# EAGLE design DRL (EAGLE 8.3.2)
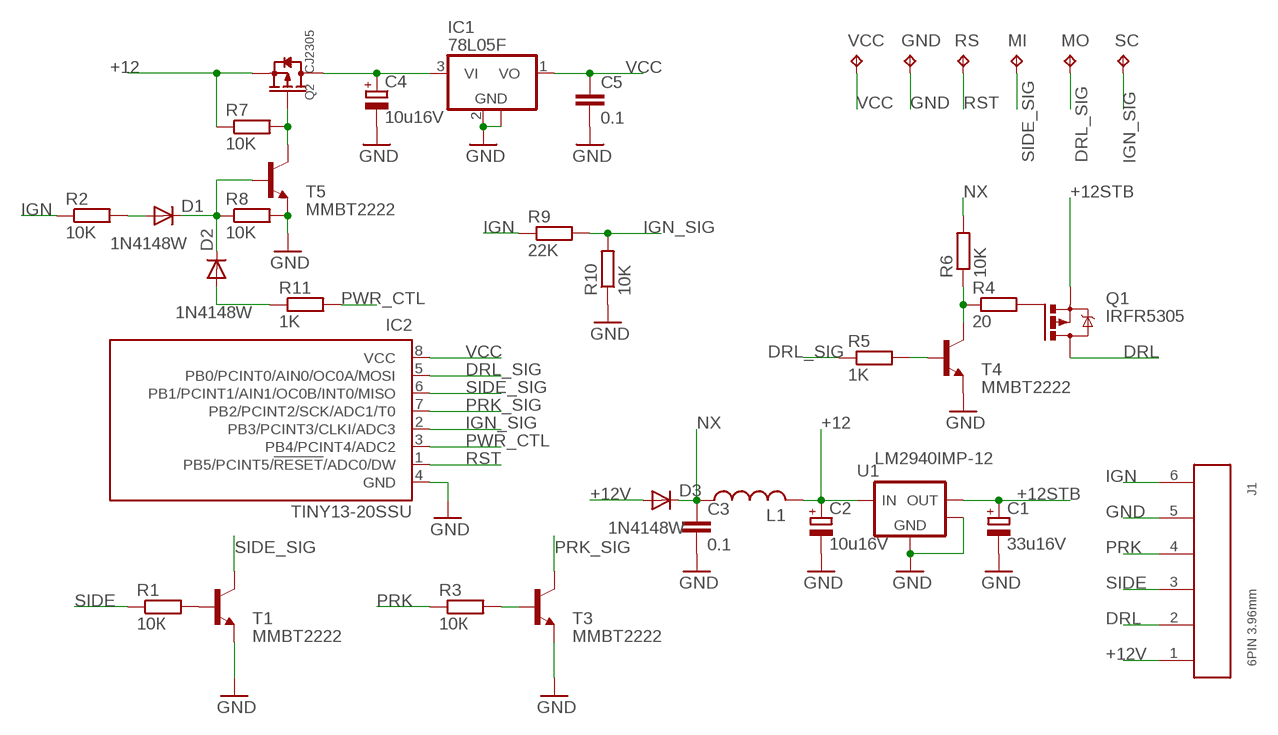
[diagram p0: schematic, sheet 1]

## Parts
C1  33u16V  CPOL-EUSMCB  [SMC_B]
C2  10u16V  CPOL-EUSMCB  [SMC_B]
C3  0.1  C-EUC0805  [C0805]
C4  10u16V  CPOL-EUSMCB  [SMC_B]
C5  0.1  C-EUC0805  [C0805]
D1  1N4148W  DIODE-DO214AC  [DO214AC]
D2  1N4148W  DIODE-DO214AC  [DO214AC]
D3  1N4148W  DIODE-DO214AC  [DO214AC]
GND  TPB2,54  [B2,54]
IC1  78L05F  [SOT89]
IC2  TINY13-20SSU  [8S1]
J1  6PIN 3.96mm  645006114822  [645006114822]
L1  L-USL5038P  [L5038P]
MI  TPB2,54  [B2,54]
MO  TPB2,54  [B2,54]
Q1  IRFR5305  [D-PAK_TO252AA]
Q2  CJ2305  SMD-MOSFET-P-CH-8V-4.1A-CJ2305(SOT-23)  [SOT-23]
R1  10К  R-EU_R0805W  [R0805W]
R2  10K  R-EU_R0805W  [R0805W]
R3  10К  R-EU_R0805W  [R0805W]
R4  20  R-EU_R0805W  [R0805W]
R5  1K  R-EU_R0805W  [R0805W]
R6  10K  R-EU_R0805W  [R0805W]
R7  10K  R-EU_R0805W  [R0805W]
R8  10K  R-EU_R0805W  [R0805W]
R9  22K  R-EU_R0805W  [R0805W]
R10  10K  R-EU_R0805W  [R0805W]
R11  1K  R-EU_R0805W  [R0805W]
RS  TPB2,54  [B2,54]
SC  TPB2,54  [B2,54]
T1  MMBT2222  MMBT2222ALT1-NPN-SOT23-BEC  [SOT23-BEC]
T3  MMBT2222  MMBT2222ALT1-NPN-SOT23-BEC  [SOT23-BEC]
T4  MMBT2222  MMBT2222ALT1-NPN-SOT23-BEC  [SOT23-BEC]
T5  MMBT2222  MMBT2222ALT1-NPN-SOT23-BEC  [SOT23-BEC]
U1  LM2940IMP-12  LM2940DCY  [SOT-223-3]
VCC  TPB2,54  [B2,54]

## Nets
+12: C2.+ L1.2 Q2.2(S) R7.1 U1.1(VIN)
+12STB: C1.+ Q1.3(S) U1.3(VOUT)
+12V: D3.A J1.1
DRL: J1.2 Q1.4(D)
DRL_SIG: IC2.5(PB0/PCINT0/AIN0/OC0A/MOSI) MO.TP R5.1
GND: C1.- C2.- C3.2 C4.- C5.2 GND.TP IC1.2(GND) IC1.2@1(GND) IC2.4(GND) J1.5 R8.2 R10.1 T1.E T3.E T4.E T5.E U1.2(GND) U1.4(TAB)
IGN: J1.6 R2.1 R9.1
IGN_SIG: IC2.2(PB3/PCINT3/CLKI/ADC3) R9.2 R10.2 SC.TP
N$1: R1.2 T1.B
N$2: R3.2 T3.B
N$3: D1.A R2.2
N$4: C4.+ IC1.3(VI) Q2.3(D)
N$5: Q2.1(G) R7.2 T5.C
N$6: Q1.1(G) R4.2
N$7: D1.C D2.C R8.1 T5.B
N$8: D2.A R11.1
N$12: R4.1 R6.1 T4.C
N$13: R5.2 T4.B
NX: C3.1 D3.C L1.1 R6.2
PRK: J1.4 R3.1
PRK_SIG: IC2.7(PB2/PCINT2/SCK/ADC1/T0) T3.C
PWR_CTL: IC2.3(PB4/PCINT4/ADC2) R11.2
RST: IC2.1(PB5/PCINT5/!RESET!/ADC0/DW) RS.TP
SIDE: J1.3 R1.1
SIDE_SIG: IC2.6(PB1/PCINT1/AIN1/OC0B/INT0/MISO) MI.TP T1.C
VCC: C5.1 IC1.1(VO) IC2.8(VCC) VCC.TP

## Library data of the parts
C1 C2 C4 = rcl:CPOL-EU: POLARIZED CAPACITOR, European symbol
C3 C5 = rcl:C-EU: CAPACITOR, European symbol
D1-D3 = diode:DIODE-: DIODE
GND MI MO RS SC VCC = testpad:TP: Test pad
IC1 = linear:78L*: POSITOIV-VOLTAGE REGULATORS Output up to 100 mA Source: Datasheet <http://focus.ti.com/lit/ds/symlink/ua78l05.pdf>
IC2 = atmel:TINY13: 8-bit AVR Microcontroller with 1K Bytes In-System Programmable Flash Source: http://www.atmel.com/dyn/resources/prod_documents/2535S.pdf; MPN: ATTINY13-20SSU; OC_FARNELL: 1455133; OC_NEWARK: 58M3771
J1 = Wurth_Elektronik_Electromechanic_Wire_to_Board_Connectors_rev17b:645006114822: WR-WTB 3.96mm Male Locking Header, 6 Pins=>Code : Con_WTB_3.96_PCB_THT_645006114822 <http://katalog.we-online.de/media/thumbs2/eican/thb_Con_WTB_3.96_PCB_THT_6450xx114822_pf2.jpg> Details see: http://katalog.we-online.de/en/em/WTB_3_96_MALE_LOCKING_HEADER_6450XX114822 Created 2014-06-05, Karrer Zheng 2014 (C) Würth Elektronik
L1 = rcl:L-US: INDUCTOR, American symbol
Q1 = transistor-power:IRF?5305: HEXFET Power MOSFET Source: http://www.irf.com/product-info/datasheets/data/irfr5305pbf.pdf
Q2 = Seeed-Transistor:SMD-MOSFET-P-CH-8V-4.1A-CJ2305(SOT-23): 305030014; MPN: CJ2305
R1-R11 = rcl:R-EU_: RESISTOR, European symbol
T1 T3-T5 = transistor:*-NPN-: NPN Transistror BF959 corrected 2008.03.06
U1 = bt_regulator:LM2940: LM2940 LDO Voltage Regulator Input Voltage Range = 6 V to 26 V Dropout Voltage Typically 0.5 V at IOUT = 1 A Reverse Battery Protection Internal Short Circuit Current Limit electrostatic discharge protection (±2kV) Tab is GND The LM2940-N/LM2940C positive voltage regulator features the ability to source 1A of output current with a dropout voltage of typically 0.5V and a maximum of 1V over the entire temperature range. Furthermore, a quiescent current reduction circuit has been included which reduces the ground current when the differential between the input voltage and the output exceeds approximately 3V. Designed also for vehicular applications, the LM2940-N/LM2940C and all regulated circuitry are protected from reverse battery installations or 2-battery jumps. During line transients, such as load dump when the input voltage can momentarily exceed the specified maximum operating voltage, the regulator will automatically shut down to protect both the internal circuits and the load. The LM2940/LM2940C cannot be harmed by temporary mirror-image insertion. Familiar regulator features such as short circuit and thermal overload protection are also provided. Datasheet.pdf <http://www.ti.com/lit/ds/symlink/lm2940-n.pdf>

## Board
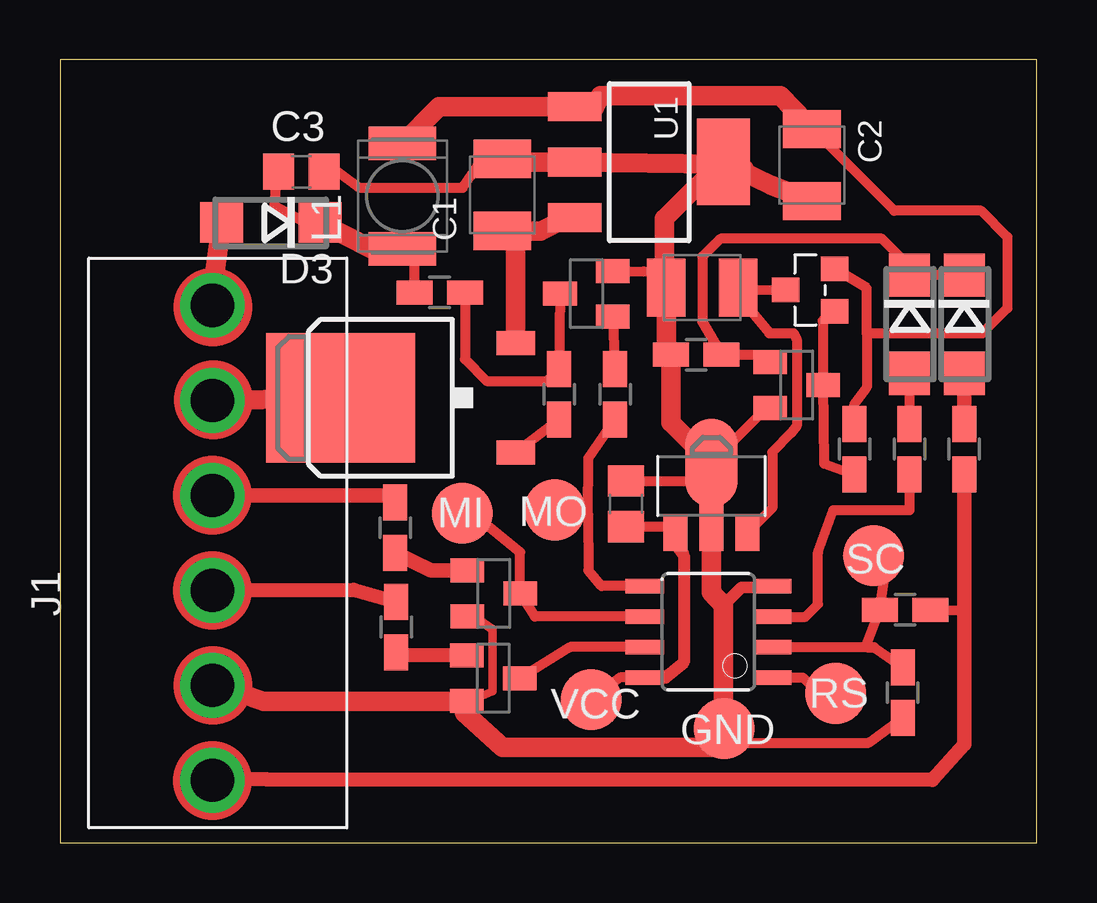
[diagram p1: board, top side]
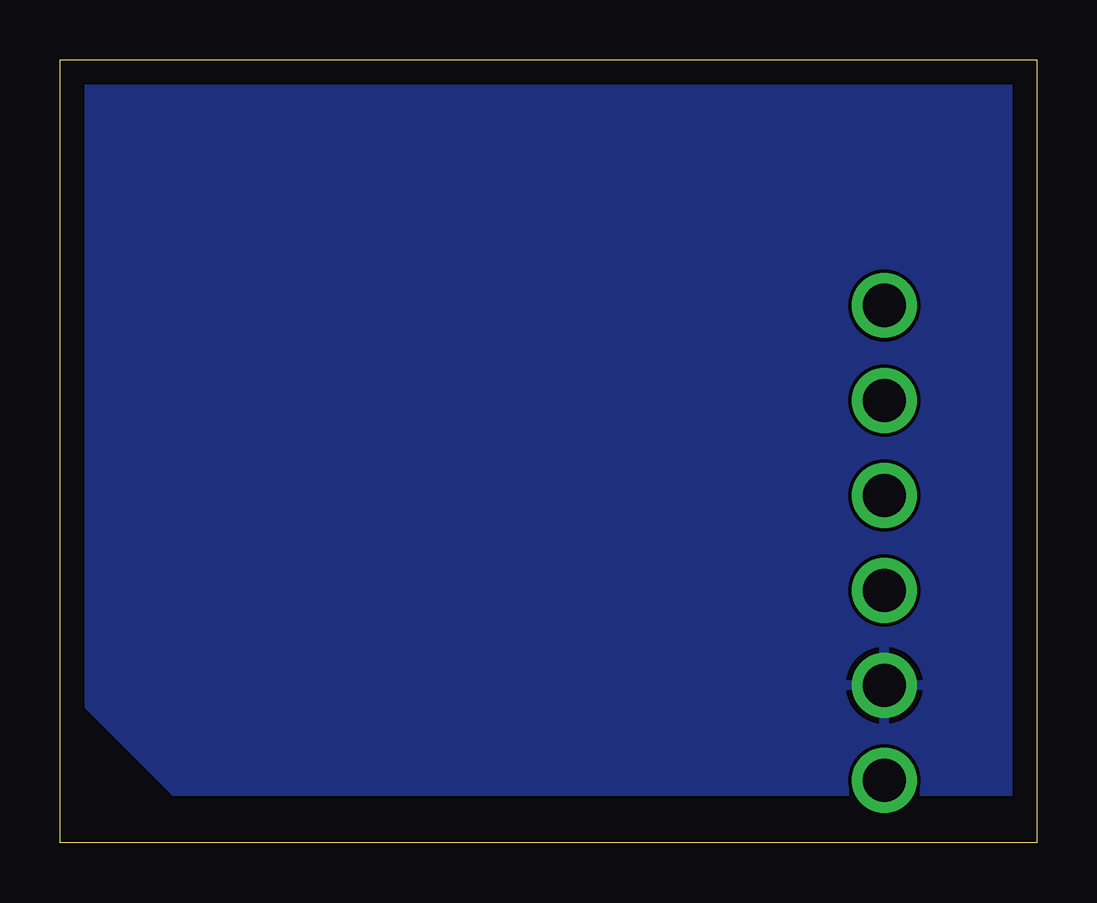
[diagram p2: board, bottom side, seen from below]

Size 40.72 x 32.63 mm. Coordinates in mm from the lower left corner, seen from the top.
Outline: 0,0 40.72,0 40.72,32.63 0,32.63 0,0
Copper layers (1*16): Top 0.035mm / dielectric 1.5mm / Bottom 0.035mm
Design rules "default": minimum track width 6mil, minimum drill 0.35mm, track to track 6mil, track to pad 6mil, pad to pad 6mil, via to via 6mil, smd to smd 6mil, copper to edge 40mil, drill to drill 6mil, minimum pad ring 10mil, minimum via ring 8mil, stop-mask expansion 4mil, vias tented up to drill 0mil, thermal gap 10mil

### Footprints (pad centres in the part's own frame; a part is rotated, then mirrored left to right if it is on the bottom)
SMC_B = smd 1.6 x 2.4: + -1.5,0; - 1.5,0
C0805 = smd 1.3 x 1.5: 1 -0.95,0; 2 0.95,0
DO214AC = smd 1.8 x 1.7: A 2.05,0; C -2.05,0
B2,54 = smd 2.54 x 2.54: TP 0,0
SOT89 = smd 1 x 1.5: 1 -1.499,-1.981; 3 1.499,-1.981 | smd 1 x 2: 2 0,-1.727 | smd 2.2 x 3.7: 2@1 0,0.94
8S1 = smd 0.6 x 1.6: 1 -1.905,-2.654; 2 -0.645,-2.654; 3 0.625,-2.654; 4 1.895,-2.654; 5 1.905,2.654; 6 0.635,2.654; 7 -0.635,2.654; 8 -1.905,2.654
645006114822 = drill 1.8: 1 9.9,0; 2 5.94,0; 3 1.98,0; 4 -1.98,0; 5 -5.94,0; 6 -9.9,0
L5038P = smd 1.4 x 2.8: 1 -2.2,0; 2 2.2,0
D-PAK_TO252AA = smd 1 x 1.6: 1 -2.28,-4.8; 3 2.28,-4.8 | smd 5.4 x 6.2: 4 0,2.5
SOT-23 = smd 1.016 x 1.143: 1 -0.889,-1.016; 2 0.889,-1.016; 3 0,1.016
R0805W = smd 1.5 x 1: 1 -1.052,0; 2 1.052,0
SOT23-BEC = smd 1 x 1.4: B -0.95,-1.1; C 0,1.1; E 0.95,-1.1
SOT-223-3 = smd 1.219 x 2.235: 1 -2.311,-3.099; 2 0,-3.099; 3 2.311,-3.099 | smd 3.6 x 2.2: 4 0,3.099

### Placement (x,y rotation side)
C1  18.44,27 90 top
C2  31.34,28.24 270 top
C3  10.06,27.97 0 top
C4  26.77,23.14 180 top
C5  23.6,14.12 90 top
D1  37.69,21.62 270 top
D2  35.41,21.62 270 top
D3  8.79,25.86 180 top
GND  27.69,4.75 0 top
IC1  27.15,14.88 0 top
IC2  27.03,8.79 90 top
J1  6.35,12.5 90 top
L1  14.27,26.95 90 top
MI  16.76,13.74 0 top
MO  20.62,13.87 0 top
Q1  14.2,18.54 90 top
Q2  31.27,23.04 90 top
R1  13.97,13.13 270 top
R2  37.69,16.41 90 top
R3  14.02,8.99 270 top
R4  20.8,18.69 270 top
R5  23.14,18.69 90 top
R6  15.82,22.94 180 top
R7  33.12,16.41 270 top
R8  26.52,20.35 180 top
R9  35.23,9.7 180 top
R10  35.13,6.25 90 top
R11  35.41,16.41 270 top
RS  32.33,6.22 0 top
SC  33.91,11.96 0 top
T1  18.08,10.39 270 top
T3  18.06,6.86 270 top
T4  21.95,22.89 90 top
T5  30.71,19.08 270 top
U1  24.56,28.37 270 top
VCC  22.15,5.97 0 top

### Tracks (layer width: path | path; a pad name or v marks a point on that pad's centre or on a via)
+12
  Top 0.406: R7.1 33.12,18.29 33.63,18.97 33.63,21.23 | 33.63,21.23 33.63,23.11 Q2.2 | 33.63,21.23 38.46,21.23 39.5,22.28 39.5,24.82 | 39.5,24.82 39.5,25.25 38.41,26.34 34.77,26.34 31.06,30.05 | 39.5,24.82 | 39.5,24.82 39.5,24.51
  Top 0.813: U1.1 21.59,30.63 22.28,30.63 22.53,31.14 30.02,31.14 31.06,30.05 C2.+ | U1.1 21.45,30.7 | U1.1 15.81,30.68 L1.2
+12STB
  Top 0.813: U1.3 21.16,26.06 20.04,25.5 18.64,25.5 | 18.64,25.5 C1.+ | Q1.3 19,25.15 18.64,25.5
+12V
  Top 0.813: J1.1 6.27,22.5 D3.A
DRL
  Top 0.813: J1.2 Q1.4
DRL_SIG
  Top 0.406: IC2.5 22.58,10.69 22.02,11.35 22.02,13.66 | 22.02,13.66 22.02,16.03 R5.1 | MO.TP 20.62,13.66 22.02,13.66
GND
  Top 0.356: 16.98,9.61 18.04,8.89 18.04,6.3 17.11,5.9
  Top 0.406: T1.E 16.98,9.61 | 17.11,5.9 T3.E | 27.66,9.88 27.66,9.93 | IC1.2@1 IC1.2 | C5.2 26.4,15.07 IC1.2@1 | C4.- 25.27,24.26 25.11,24.38 | T5.E 29.45,18.12 IC1.2@1 | 27.71,28.37 27.71,28.88 27.43,29.29 U1.4 | 27.71,28.37 27.71,28.21 | 27.84,28.5 27.71,28.37 | T4.E 24.32,23.81 25.2,23.9 | GND.TP 28.14,4.75 28.3,4.17 33.72,4.17 R10.1 | C3.2 11.58,27.97 12.47,27.3 16.79,27.3 17.42,28.25 18.44,28.25 18.57,28.37
  Top 0.508: IC2.4 28.41,10.63 27.66,9.88
  Top 0.813: IC1.2 27.15,10.44 27.66,9.88 27.66,4.77 GND.TP 27.61,3.96 18.44,3.96 16.86,5.42 T3.E 17.05,5.89 8.48,5.89 6.6,6.53 J1.5 | 27.43,29.29 27.51,28.3 U1.2 18.57,28.37 C1.- | 28.5,28.09 27.71,28.88 | IC1.2@1 25.47,17.51 R8.2 25.27,20.54 C4.- 25.2,23.21 25.2,23.9 25.2,26.01 27.71,28.52 U1.4 29.64,27.41 C2.-
  pour Bottom: -2.11,31.19 -2.11,31.57 1.02,34.7 5.82,34.7 8.36,37.24 36.5,37.24 40.21,33.53 40.21,6.4 35.97,2.16 -0.76,2.16 -1.93,3.33 -1.93,31.39 -1.98,31.45
IGN
  Top 0.406: R9.1 37.69,9.68
  Top 0.61: J1.6 6.4,2.67 8.61,2.64 36.37,2.62 37.69,4.09 37.69,9.68 R2.1
IGN_SIG
  Top 0.406: 33.63,8.14 IC2.2 | 33.63,8.14 33.93,8.14 R10.2 | 33.63,8.14 33.59,8.18 R9.2 34.46,11.59 SC.TP
N$1
  Top 0.61: T1.B 15.47,11.34 R1.2
N$2
  Top 0.61: T3.B 14.08,7.83 R3.2
N$3
  Top 0.61: R2.2 D1.A
N$4
  Top 0.406: Q2.3 28.4,23.01 C4.+ 28.27,22.78 29.57,21.23 30.58,21.23 30.71,20.98 30.71,17.39 30.5,17.09 29.69,16.28 29.69,13.94 IC1.3
N$5
  Top 0.406: Q2.1 31.8,21.76 T5.C 31.85,15.8 R7.2
N$6
  Top 0.406: Q1.1 R4.2
N$7
  Top 0.406: T5.B 28.91,20.34 R8.1 26.77,21.7 26.77,24.44 27.53,25.17 34.27,25.17 35.77,23.66 D2.C D1.C
N$8
  Top 0.406: D2.A R11.1
N$12
  Top 0.406: T4.C R4.1 20.76,19.7 | 20.76,19.7 20.49,19.43 | 16.92,22.9 R6.1 16.88,20.16 17.78,19.25 20.31,19.25 20.76,19.7
N$13
  Top 0.406: R5.2 23.09,21.34 T4.B
NX
  Top 0.406: R6.2 14.77,24.25 L1.1 | D3.C 10.21,25.86 8.94,26.54 9.04,27.9 C3.1
  Top 0.813: L1.1 13.01,24.75 D3.C
PRK
  Top 0.61: R3.1 12.23,10.53 J1.4
PRK_SIG
  Top 0.406: T3.C 21.27,8.15 IC2.7
PWR_CTL
  Top 0.406: IC2.3 31.08,9.41 31.6,9.93 31.6,12.09 32.23,13.87 35.41,13.87 R11.2
RST
  Top 0.406: IC2.1 30.96,6.88 31.73,6.12 31.73,5.61 RS.TP
SIDE
  Top 0.61: R1.1 14.03,14.46 J1.3
SIDE_SIG
  Top 0.406: IC2.6 19.79,9.42 T1.C 19.19,12.11 17.35,13.59 MI.TP
VCC
  Top 0.406: 24.49,6.77 IC2.8 | C5.1 25.38,13.17 IC1.1 25.65,12.45 | 25.25,6.88 IC2.8 | IC2.8 23.34,6.88 VCC.TP
  Top 0.508: 25.65,12.45 26.01,11.96 26.01,7.52 25.25,6.88
(copper drawn outside any net)
  shapes: Top circle x6